# EasyEDA Pro project miniMQ.epro, schematic Encoder
Board Name: Encoder; Create Date: 2026-09-02; Page Name: P1; Project Name: MagicQ Compact Mini Connect; Schematic Name: Encoder; Update Date: 2026-09-14; Company: EasyEDA.com; Page Size: A4; Version: V1.0
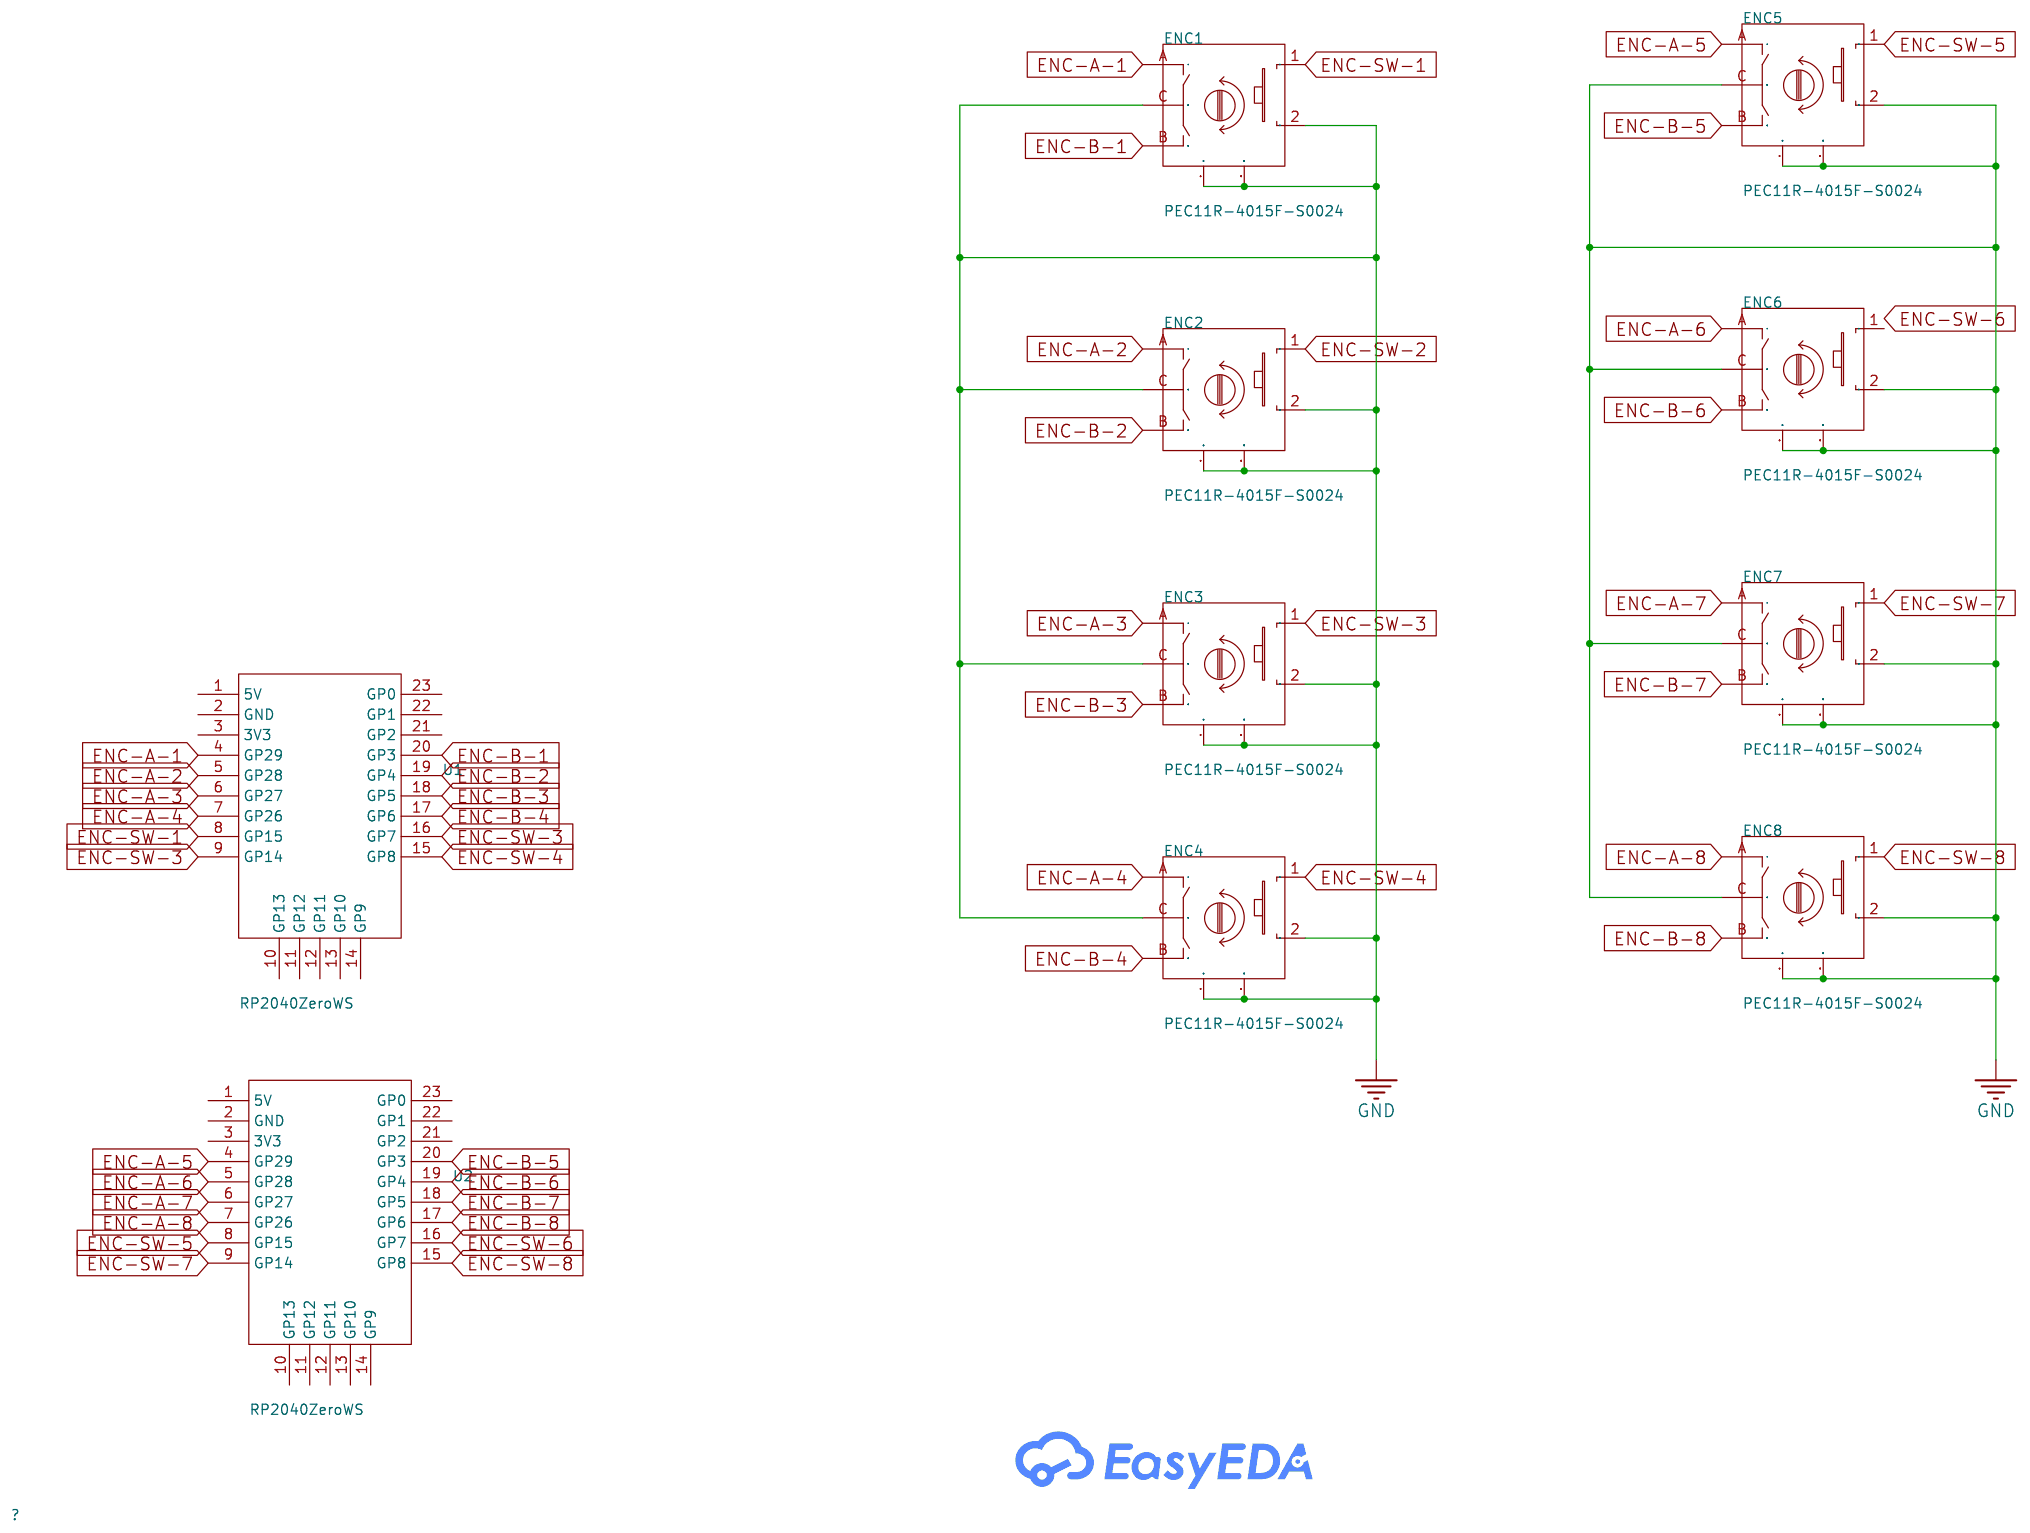
[diagram p1: schematic sheet]

## Parts
ENC1  PEC11R-4015F-S0024  [SW-TH_PEC11R-4XXXF-SXXXX]
ENC2  PEC11R-4015F-S0024  [SW-TH_PEC11R-4XXXF-SXXXX]
ENC3  PEC11R-4015F-S0024  [SW-TH_PEC11R-4XXXF-SXXXX]
ENC4  PEC11R-4015F-S0024  [SW-TH_PEC11R-4XXXF-SXXXX]
ENC5  PEC11R-4015F-S0024  [SW-TH_PEC11R-4XXXF-SXXXX]
ENC6  PEC11R-4015F-S0024  [SW-TH_PEC11R-4XXXF-SXXXX]
ENC7  PEC11R-4015F-S0024  [SW-TH_PEC11R-4XXXF-SXXXX]
ENC8  PEC11R-4015F-S0024  [SW-TH_PEC11R-4XXXF-SXXXX]
U1  RP2040ZeroWS  [RP2040]
U2  RP2040ZeroWS  [RP2040]

## Library data of the parts
ENC1-ENC8 = encoder: Manufacturer: BOURNS; Supplier: LCSC; Supplier Part: C143789; JLCPCB Part Class: Extended Part
U1 U2 = RP2040

## Nets
GND: ENC1.2 ENC1.C ENC1.MT1 ENC1.MT2 ENC2.2 ENC2.C ENC2.MT1 ENC2.MT2 ENC3.2 ENC3.C ENC3.MT1 ENC3.MT2 ENC4.2 ENC4.C ENC4.MT1 ENC4.MT2 ENC5.2 ENC5.C ENC5.MT1 ENC5.MT2 ENC6.2 ENC6.C ENC6.MT1 ENC6.MT2 ENC7.2 ENC7.C ENC7.MT1 ENC7.MT2 ENC8.2 ENC8.C ENC8.MT1 ENC8.MT2
ENC-A-1: ENC1.A U1.4(GP29)
ENC-A-2: ENC2.A U1.5(GP28)
ENC-A-3: ENC3.A U1.6(GP27)
ENC-A-4: ENC4.A U1.7(GP26)
ENC-A-5: ENC5.A U2.4(GP29)
ENC-A-6: ENC6.A U2.5(GP28)
ENC-A-7: ENC7.A U2.6(GP27)
ENC-A-8: ENC8.A U2.7(GP26)
ENC-B-1: ENC1.B U1.20(GP3)
ENC-B-2: ENC2.B U1.19(GP4)
ENC-B-3: ENC3.B U1.18(GP5)
ENC-B-4: ENC4.B U1.17(GP6)
ENC-B-5: ENC5.B U2.20(GP3)
ENC-B-6: ENC6.B U2.19(GP4)
ENC-B-7: ENC7.B U2.18(GP5)
ENC-B-8: ENC8.B U2.17(GP6)
ENC-SW-1: ENC1.1 U1.8(GP15)
ENC-SW-2: ENC2.1
ENC-SW-3: ENC3.1 U1.9(GP14) U1.16(GP7)
ENC-SW-4: ENC4.1 U1.15(GP8)
ENC-SW-5: ENC5.1 U2.8(GP15)
ENC-SW-6: U2.16(GP7)
ENC-SW-7: ENC7.1 U2.9(GP14)
ENC-SW-8: ENC8.1 U2.15(GP8)

Not connected (* = marked no-connect by the designer): ENC6 1; U1 1(5V) 2(GND) 3(3V3) 10(GP13) 11(GP12) 12(GP11) 13(GP10) 14(GP9) 21(GP2) 22(GP1) 23(GP0); U2 1(5V) 2(GND) 3(3V3) 10(GP13) 11(GP12) 12(GP11) 13(GP10) 14(GP9) 21(GP2) 22(GP1) 23(GP0)
